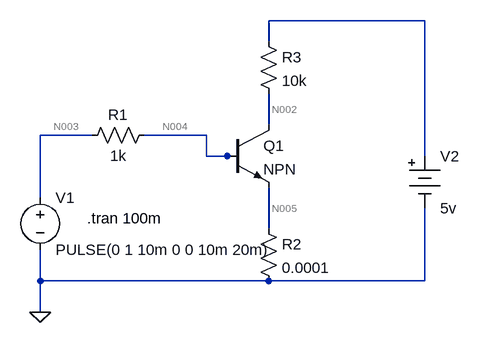
[diagram p0: schematic Yoneda-p102_Tr-switching_Re2.asc]
Yoneda-p102_Tr-switching_Re2.asc, the LTspice schematic file:
Version 4
SHEET 1 880 680
WIRE 672 -192 432 -192
WIRE 432 -160 432 -192
WIRE 432 -32 432 -80
WIRE 160 -16 80 -16
WIRE 336 -16 240 -16
WIRE 336 16 336 -16
WIRE 368 16 336 16
WIRE 384 16 368 16
WIRE 672 16 672 -192
WIRE 80 80 80 -16
WIRE 432 128 432 64
WIRE 80 208 80 160
WIRE 432 208 80 208
WIRE 672 208 672 96
WIRE 672 208 432 208
WIRE 80 256 80 208
FLAG 80 256 0
SYMBOL voltage 80 64 R0
WINDOW 123 0 0 Left 2
WINDOW 39 0 0 Left 2
SYMATTR InstName V1
SYMATTR Value PULSE(0 1 10m 0 0 10m 20m)
SYMBOL res 144 0 R270
WINDOW 0 32 56 VTop 2
WINDOW 3 0 56 VBottom 2
SYMATTR InstName R1
SYMATTR Value 1k
SYMBOL res 416 112 R0
SYMATTR InstName R2
SYMATTR Value 0.0001
SYMBOL res 416 -176 R0
SYMATTR InstName R3
SYMATTR Value 10k
SYMBOL Misc\\battery 672 0 R0
SYMATTR InstName V2
SYMATTR Value 5v
SYMBOL npn 368 -32 R0
SYMATTR InstName Q1
TEXT 152 112 Left 2 !.tran 100m

The netlist it stands for:
* Yoneda-p102_Tr-switching_Re2.asc
V1 N003 0 PULSE(0 1 10m 0 0 10m 20m)
R1 N003 N004 1k
R2 N005 0 0.0001
R3 N001 N002 10k
V2 N001 0 5v
Q1 N002 N004 N005 0 NPN
.model NPN NPN
.model PNP PNP
.lib standard.bjt
.tran 100m
.backanno
.end

* Results of the author's LTspice run, read from the files saved beside the schematic
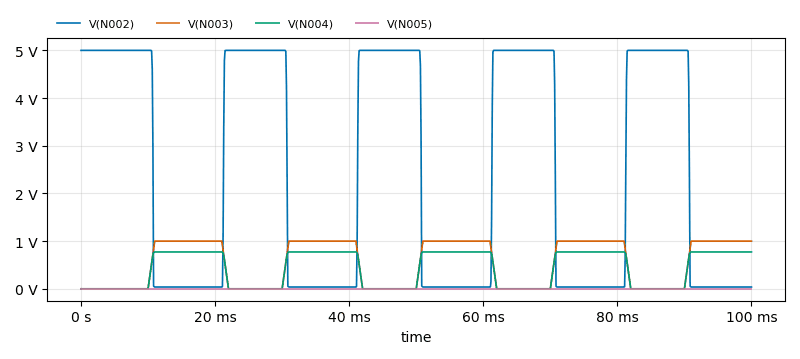
[diagram p1: Transient Analysis of Yoneda-p102_Tr-switching_Re2.asc, plotted from the saved traces]
* Transient Analysis, 1 run:
*   V(N002): min 37.56 mV, max 5 V, average 2.448 V, rms 3.473 V, last 37.57 mV
*   V(N003): min 0 V, max 1 V, average 535 mV, rms 721.5 mV, last 1 V
*   V(N004): min 0 V, max 772.4 mV, average 420.7 mV, rms 564.3 mV, last 772.4 mV
*   V(N005): min 0 V, max 72.38 nV, average 36.94 nV, rms 51.46 nV, last 72.38 nV